# Altium schematic sheet Sheet_1_2025-01-28.schdoc
size 133 x 97 mm
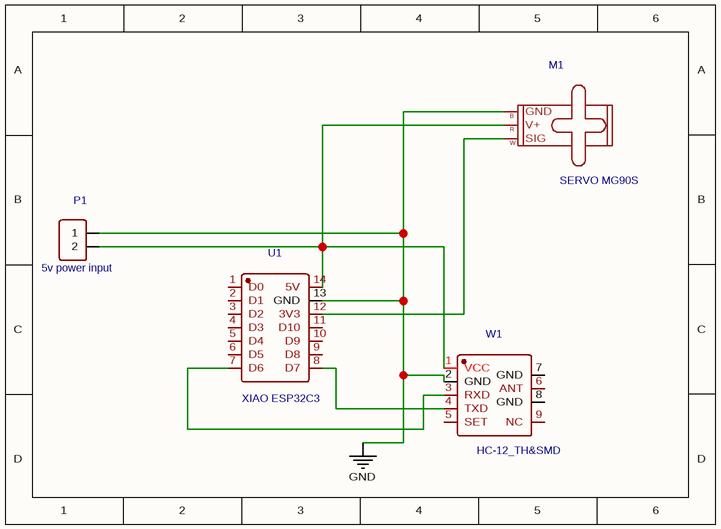
[diagram p0: Sheet_1_2025-01-28.schdoc]

## Parts
M1  SERVO MG90S  [1X03]
P1  5v power input  [HDR-F-2.54_1X2]
U1  XIAO ESP32C3  [COMM-SMD_KQ-2801_V106]
W1  HC-12_TH&SMD  [COMM-SMD_HC-12]

## Nets
GND: M1.3(GND) P1.1 U1.13(GND) W1.2(GND)
NetM1_1: M1.1(SIG) U1.12(3V3)
NetM1_2: M1.2(V+) P1.2 U1.14(5V) W1.1(VCC)
NetU1_7: U1.7(D6) W1.3(RXD)
NetU1_8: U1.8(D7) W1.4(TXD)

Not connected (* = marked no-connect by the designer): U1 1(D0) 2(D1) 3(D2) 4(D3) 5(D4) 6(D5) 9(D8) 10(D9) 11(D10); W1 5(SET) 6(ANT) 7(GND) 8(GND) 9(NC)

## Notes on the sheet
- (in symbol SERVO MG90S) B; R; W

## Library data of the parts
M1 = SERVO MG90S: description: Small servo motor; Contributor: SparkFun; spicePre: M; spiceSymbolName: SMALL_SERVO
P1 = 5v power input: Contributor: LCEDA_Lib; Supplier Part: C49661; Supplier: LCSC; spicePre: H; spiceSymbolName: HDR-F-2.54_1x2
U1 = XIAO ESP32C3: Manufacturer: null; Contributor: lcsc; Supplier: LCSC; Supplier Part: C19189385; Manufacturer Part: XIAO ESP32C3; JLCPCB Part Class: Extended Part; spicePre: U; spiceSymbolName: XIAO ESP32C3
W1 = HC-12_TH&SMD: Manufacturer: null; Contributor: lcsc; Supplier: LCSC; Supplier Part: C9900113373; Manufacturer Part: HC-12_TH&SMD; spicePre: W; spiceSymbolName: HC-12_TH&SMD